# Altium schematic sheet BMS_bat_fe.SchDoc
size 420 x 297 mm; SheetNumber: 3; SheetTotal: 5
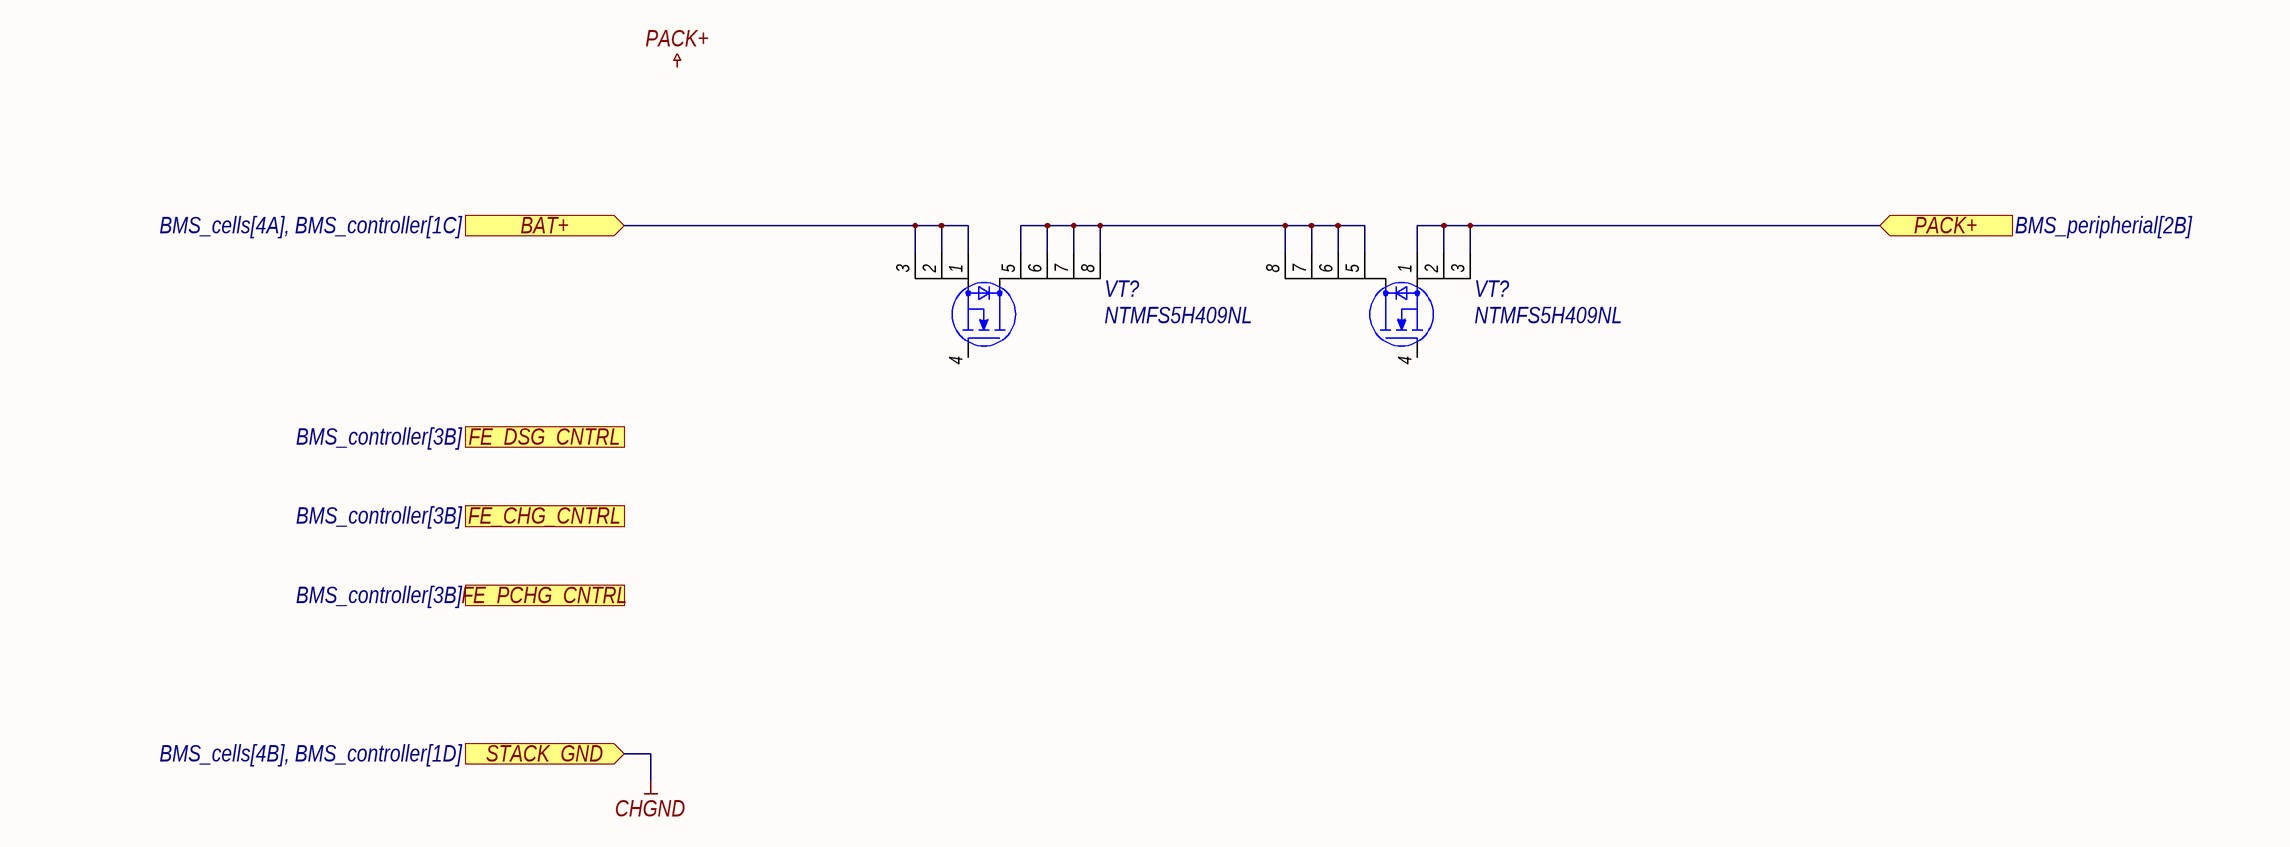
[diagram p0: BMS_bat_fe.SchDoc]

## Parts
(Parts that share a designator on the sheet are numbered #1, #2 ... from top to bottom, then left to right.)
VT?#1  NTMFS5H409NL  [DFN5]
VT?#2  NTMFS5H409NL  [DFN5]

## Ports
BAT+ (in, see BMS_cells[4A], BMS_controller[1C]), FE_CHG_CNTRL (in, see BMS_controller[3B]), FE_DSG_CNTRL (in, see BMS_controller[3B]), FE_PCHG_CNTRL (in, see BMS_controller[3B]), PACK+ (in, see BMS_peripherial[2B]), STACK_GND (in, see BMS_cells[4B], BMS_controller[1D])

## Nets
CHGND: port STACK_GND
BAT+: VT?#1.1(S) VT?#1.2(S) VT?#1.3(S) ; port BAT+
PACK+: VT?#2.1(S) VT?#2.2(S) VT?#2.3(S) ; port PACK+
NetVT?#1_5: VT?#1.5(D) VT?#1.6(D) VT?#1.7(D) VT?#1.8(D) VT?#2.5(D) VT?#2.6(D) VT?#2.7(D) VT?#2.8(D)

Not connected (* = marked no-connect by the designer): VT?#1 4(G); VT?#2 4(G)

## Notes on the sheet
- Labels drawn without touching a wire or pin: PACK+
- Подп. и дата
- Инв. № дубл.
- Взам. инв. №
- Инв. № подл.
- Лист
- Изм.
- № докум.
- Подп.
- Дата
- Копировал
- Формат
- А3

## Library data of the parts
VT?#1 VT?#2 = NTMFS5H409NL: 40 V, 1.1 m, 270 A, Single N−Channel; Name: NTMFS5H409NL